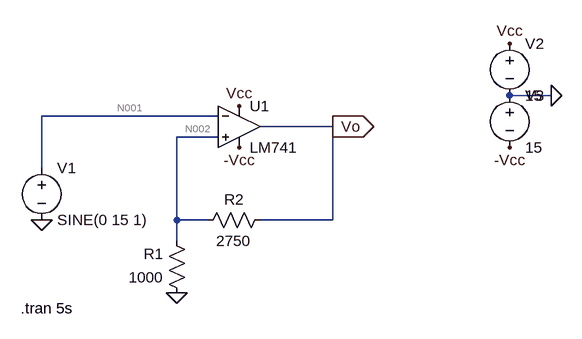
[diagram p0: schematic schmitt_opamp.asc]
schmitt_opamp.asc, the LTspice schematic file:
Version 4
SHEET 1 880 680
WIRE 688 128 624 128
WIRE 176 160 -96 160
WIRE 352 176 240 176
WIRE 176 192 112 192
WIRE -96 240 -96 160
WIRE 112 320 112 192
WIRE 160 320 112 320
WIRE 352 320 352 176
WIRE 352 320 240 320
WIRE 112 352 112 320
FLAG 688 128 0
FLAG 624 48 Vcc
FLAG 208 144 Vcc
FLAG 624 208 -Vcc
FLAG 208 208 -Vcc
FLAG 112 432 0
FLAG -96 320 0
FLAG 352 176 Vo
IOPIN 352 176 Out
SYMBOL OpAmps\\LM741 208 112 R0
SYMATTR InstName U1
SYMBOL voltage -96 224 R0
WINDOW 123 0 0 Left 0
WINDOW 39 0 0 Left 0
SYMATTR InstName V1
SYMATTR Value SINE(0 15 1)
SYMBOL voltage 624 32 R0
SYMATTR InstName V2
SYMATTR Value 15
SYMBOL voltage 624 112 R0
SYMATTR InstName V3
SYMATTR Value 15
SYMBOL res 128 448 R180
WINDOW 0 36 76 Left 2
WINDOW 3 36 40 Left 2
SYMATTR InstName R1
SYMATTR Value 1000
SYMBOL res 144 336 R270
WINDOW 0 32 56 VTop 2
WINDOW 3 0 56 VBottom 2
SYMATTR InstName R2
SYMATTR Value 2750
TEXT -128 456 Left 2 !.tran 5s

The netlist it stands for:
* schmitt_opamp.asc
XU1 N002 N001 Vcc -Vcc Vo LM741  ; pins In+ In- V+ V- OUT
V1 N001 0 SINE(0 15 1)
V2 Vcc 0 15
V3 0 -Vcc 15
R1 0 N002 1000
R2 N002 Vo 2750
.tran 5s
.lib LM741.lib
.backanno
.end

* Results of the author's LTspice run, read from the files saved beside the schematic
* Operating Point, zero values left out:
*   V(n002) = -1 mV
*   V(-vcc) = -15 V
*   V(vcc) = 15 V
*   V(vo) = -3.591 mV
*   I(R2) = 942.1 nA
*   I(R1) = 1 µA
*   I(V3) = -1.702 mA
*   I(V2) = -1.701 mA
*   I(V1) = -101.9 nA
*   Ix(u1:1) = 57.86 nA
*   Ix(u1:2) = 101.9 nA
*   Ix(u1:99) = 1.701 mA
*   Ix(u1:50) = -1.702 mA
*   Ix(u1:28) = 942.1 nA
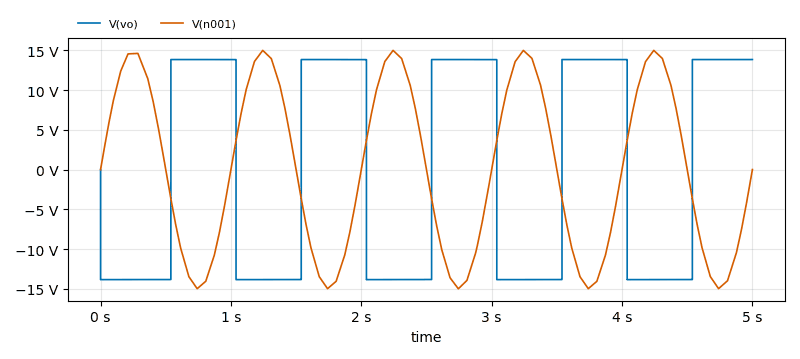
[diagram p1: Transient Analysis of schmitt_opamp.asc, plotted from the saved traces]
* Transient Analysis, 1 run:
*   V(vo): min -13.84 V, max 13.84 V, average -217.4 mV, rms 13.84 V, last 13.84 V
*   V(n001): min -14.99 V, max 14.99 V, average -1.099 mV, rms 10.53 V, last 0 V